# EAGLE schematic univ_3-1-0-x-rev1 (EAGLE 7.2.0)
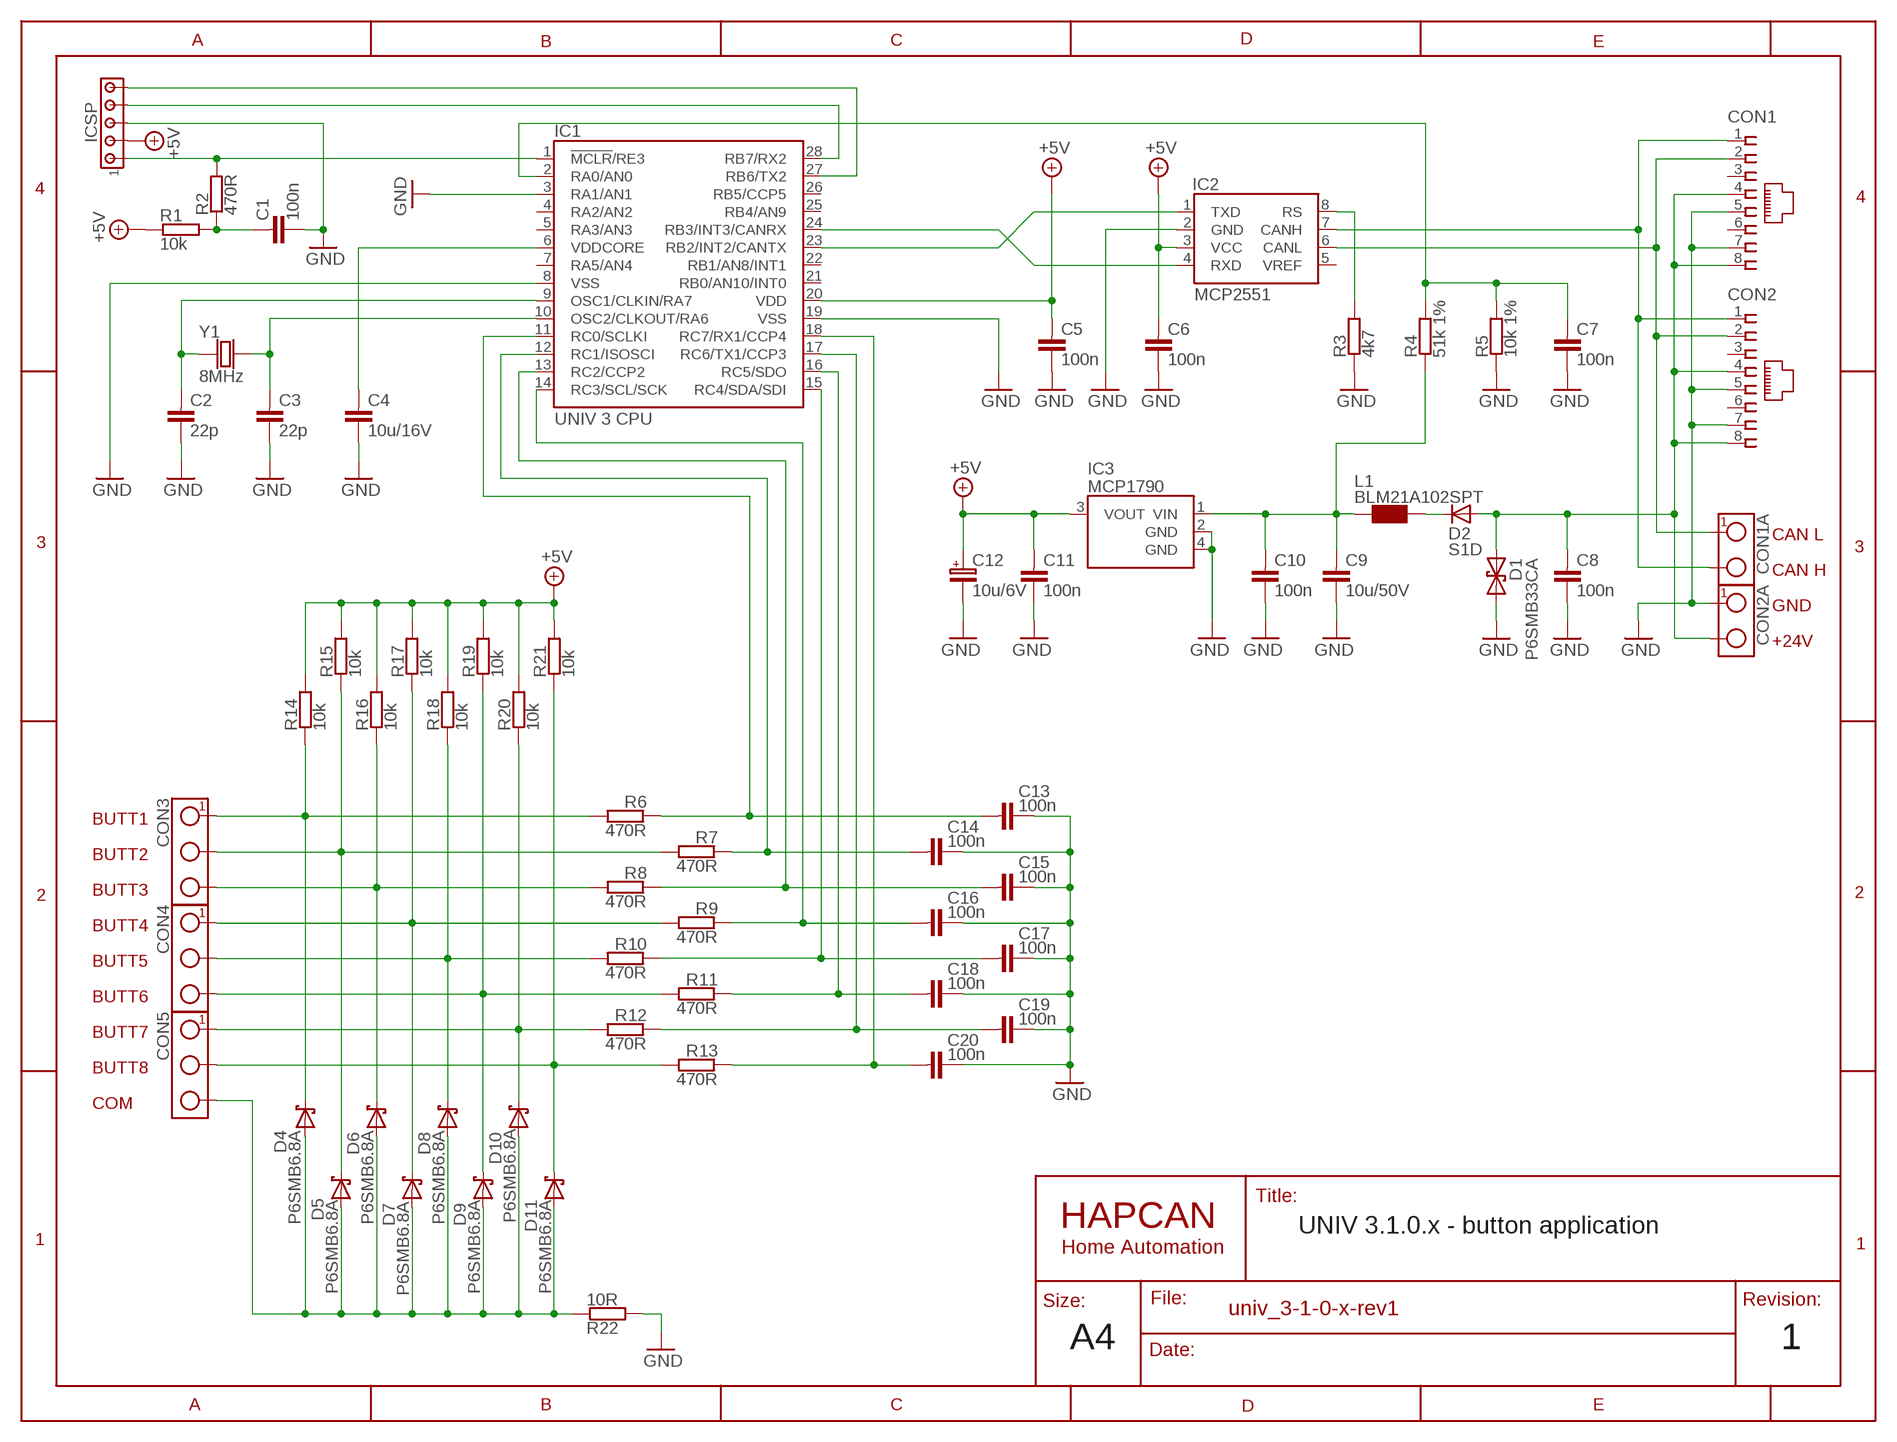
[diagram p0: schematic, sheet 1]

## Parts
C1  100n  CAPACITOR0805  [0805]
C2  22p  CAPACITOR0805  [0805]
C3  22p  CAPACITOR0805  [0805]
C4  10u/16V  CAPACITOR0805  [0805]
C5  100n  CAPACITOR0805  [0805]
C6  100n  CAPACITOR0805  [0805]
C7  100n  CAPACITOR0805  [0805]
C8  100n  CAPACITOR0805  [0805]
C9  10u/50V  CAPACITOR1210  [1210]
C10  100n  CAPACITOR0805  [0805]
C11  100n  CAPACITOR0805  [0805]
C12  10u/6V  CAPACITOR-POLARIZED-SMC_B  [SMC_B]
C13  100n  CAPACITOR0805  [0805]
C14  100n  CAPACITOR0805  [0805]
C15  100n  CAPACITOR0805  [0805]
C16  100n  CAPACITOR0805  [0805]
C17  100n  CAPACITOR0805  [0805]
C18  100n  CAPACITOR0805  [0805]
C19  100n  CAPACITOR0805  [0805]
C20  100n  CAPACITOR0805  [0805]
CON1  RJ45-SOCKET  [RJ45-PCB-SOCKET]
CON1A  TERMINAL-2  TERMINAL-2-5X10,5MM  [ARK2-5X10,5MM]
CON2  RJ45-SOCKET  [RJ45-PCB-SOCKET]
CON2A  TERMINAL-2  TERMINAL-2-5X10,5MM  [ARK2-5X10,5MM]
CON3  TERMINAL-3  TERMINAL-3-5X10.5MM  [ARK3-5X10.5MM]
CON4  TERMINAL-3  TERMINAL-3-5X10.5MM  [ARK3-5X10.5MM]
CON5  TERMINAL-3  TERMINAL-3-5X10.5MM  [ARK3-5X10.5MM]
D1  P6SMB33CA  DIODE_TRANSIL  [DO-214_TRANSIL2]
D2  S1D  DIODEDO-214  [DO-214]
D4  P6SMB6.8A  DIODE_TRANSIL1  [DO-214]
D5  P6SMB6.8A  DIODE_TRANSIL1  [DO-214]
D6  P6SMB6.8A  DIODE_TRANSIL1  [DO-214]
D7  P6SMB6.8A  DIODE_TRANSIL1  [DO-214]
D8  P6SMB6.8A  DIODE_TRANSIL1  [DO-214]
D9  P6SMB6.8A  DIODE_TRANSIL1  [DO-214]
D10  P6SMB6.8A  DIODE_TRANSIL1  [DO-214]
D11  P6SMB6.8A  DIODE_TRANSIL1  [DO-214]
IC1  UNIV 3 CPU  UNIV3(CPU)  [UNIV3CPU]
IC2  MCP2551  [SO-08]
IC3  MCP1790  [SOT-223]
ICSP  HEADER5  [SIP-5]
L1  BLM21A102SPT  BLMXXX  [0805]
R1  10k  RESISTOR  [0805]
R2  470R  RESISTOR  [0805]
R3  4k7  RESISTOR  [0805]
R4  51k 1%  RESISTOR  [0805]
R5  10k 1%  RESISTOR  [0805]
R6  470R  RESISTOR  [0805]
R7  470R  RESISTOR  [0805]
R8  470R  RESISTOR  [0805]
R9  470R  RESISTOR  [0805]
R10  470R  RESISTOR  [0805]
R11  470R  RESISTOR  [0805]
R12  470R  RESISTOR  [0805]
R13  470R  RESISTOR  [0805]
R14  10k  RESISTOR  [0805]
R15  10k  RESISTOR  [0805]
R16  10k  RESISTOR  [0805]
R17  10k  RESISTOR  [0805]
R18  10k  RESISTOR  [0805]
R19  10k  RESISTOR  [0805]
R20  10k  RESISTOR  [0805]
R21  10k  RESISTOR  [0805]
R22  10R  RESISTOR  [0805]
Y1  8MHz  CRYSTALHC49V  [CRYSTAL-HC49V]

## Nets
+5V: C5.1 C6.1 C11.1 C12.+ IC1.20(VDD) IC2.3(VCC) IC3.3(VOUT) ICSP.2 R1.1 R14.2 R15.2 R16.2 R17.2 R18.2 R19.2 R20.2 R21.2
GND: C1.2 C2.2 C3.2 C4.2 C5.2 C6.2 C7.2 C8.2 C9.2 C10.2 C11.2 C12.- C13.2 C14.2 C15.2 C16.2 C17.2 C18.2 C19.2 C20.2 CON1.5 CON1.7 CON2.5 CON2.7 CON2A.1 D1.C IC1.3(RA1/AN1) IC1.8(VSS) IC1.19(VSS) IC2.2(GND) IC3.2(GND) IC3.4(GND) ICSP.3 R3.1 R5.1 R22.2
N$1: CON5.3 D4.A D5.A D6.A D7.A D8.A D9.A D10.A D11.A R22.1
N$2: IC1.24(RB3/INT3/CANRX) IC2.4(RXD)
N$3: IC1.23(RB2/INT2/CANTX) IC2.1(TXD)
N$4: CON1.1 CON1A.2 CON2.1 IC2.7(CANH)
N$5: CON3.1 D4.C R6.2 R14.1
N$6: CON3.3 D6.C R8.2 R16.1
N$7: C1.1 R1.2 R2.1
N$8: IC1.1(!MCLR!/RE3) ICSP.1 R2.2
N$9: C8.1 CON1.4 CON1.8 CON2.4 CON2.8 CON2A.2 D1.A D2.A
N$10: IC1.28(RB7/RX2) ICSP.4
N$11: C14.1 IC1.12(RC1/ISOSCI) R7.1
N$12: IC2.8(RS) R3.2
N$13: CON3.2 D5.C R7.2 R15.1
N$14: IC1.27(RB6/TX2) ICSP.5
N$15: C3.1 IC1.10(OSC2/CLKOUT/RA6) Y1.2
N$16: C7.1 IC1.2(RA0/AN0) R4.2 R5.2
N$17: C9.1 C10.1 IC3.1(VIN) L1.1 R4.1
N$19: C15.1 IC1.13(RC2/CCP2) R8.1
N$21: CON4.1 D7.C R9.2 R17.1
N$22: C16.1 IC1.14(RC3/SCL/SCK) R9.1
N$23: CON4.3 D9.C R11.2 R19.1
N$24: CON5.1 D10.C R12.2 R20.1
N$25: C13.1 IC1.11(RC0/SCLKI) R6.1
N$27: CON1.2 CON1A.1 CON2.2 IC2.6(CANL)
N$29: C17.1 IC1.15(RC4/SDA/SDI) R10.1
N$30: CON4.2 D8.C R10.2 R18.1
N$32: CON5.2 D11.C R13.2 R21.1
N$40: C2.1 IC1.9(OSC1/CLKIN/RA7) Y1.1
N$45: C18.1 IC1.16(RC5/SDO) R11.1
N$46: C19.1 IC1.17(RC6/TX1/CCP3) R12.1
N$47: C20.1 IC1.18(RC7/RX1/CCP4) R13.1
N$56: C4.1 IC1.6(VDDCORE)
N$67: D2.C L1.2
Unconnected: CON1.3 CON1.6 CON2.3 CON2.6 IC1.4(RA2/AN2) IC1.5(RA3/AN3) IC1.7(RA5/AN4) IC1.21(RB0/AN10/INT0) IC1.22(RB1/AN8/INT1) IC1.25(RB4/AN9) IC1.26(RB5/CCP5) IC2.5(VREF)

## Notes on the sheet
- CAN L
- CAN H
- GND
- +24V
- BUTT1
- BUTT2
- BUTT3
- BUTT4
- BUTT5
- BUTT6
- BUTT7
- BUTT8
- COM
- UNIV 3.1.0.x - button application
- A4 | 1

## Library data of the parts
C1-C11 C13-C20 = HAPCAN_devices - UNIV3:CAPACITOR: HAPCAN Capacitor
C12 = HAPCAN_devices - UNIV3:CAPACITOR-POLARIZED: HAPCAN Polarazied Capacitor
CON1 CON2 = HAPCAN_devices - UNIV3:RJ45-SOCKET: HAPCAN RJ45 socket
CON1A CON2A = HAPCAN_devices - UNIV3:TERMINAL-2: HAPCAN Terminal Block - 2 way
CON3-CON5 = HAPCAN_devices - UNIV3:TERMINAL-3: HAPCAN Terminal Block - 3 way
D1 = HAPCAN_devices - UNIV3:DIODE_TRANSIL: Transil diode
D2 = HAPCAN_devices - UNIV3:DIODE: Diode
D4-D11 = HAPCAN_devices - UNIV3:DIODE_TRANSIL1: Unidirectional transil diode
IC1 = HAPCAN_devices - UNIV3:UNIV3(CPU): HAPCAN Microcontroller UNIV 3 (CPU)
IC2 = HAPCAN_devices - UNIV3:MCP2551: HAPCAN CAN Tranceiver
IC3 = HAPCAN_devices - UNIV3:MCP1790: 70 mA, High Voltage Regulator
ICSP = HAPCAN_devices - UNIV3:HEADER5: HAPCAN Header 5
L1 = HAPCAN_devices - UNIV3:BLMXXX: Choke
R1-R22 = HAPCAN_devices - UNIV3:RESISTOR: HAPCAN Resistor
Y1 = HAPCAN_devices - UNIV3:CRYSTAL: HAPCAN Crystal